# Altium project Logic_RF.PrjPcb
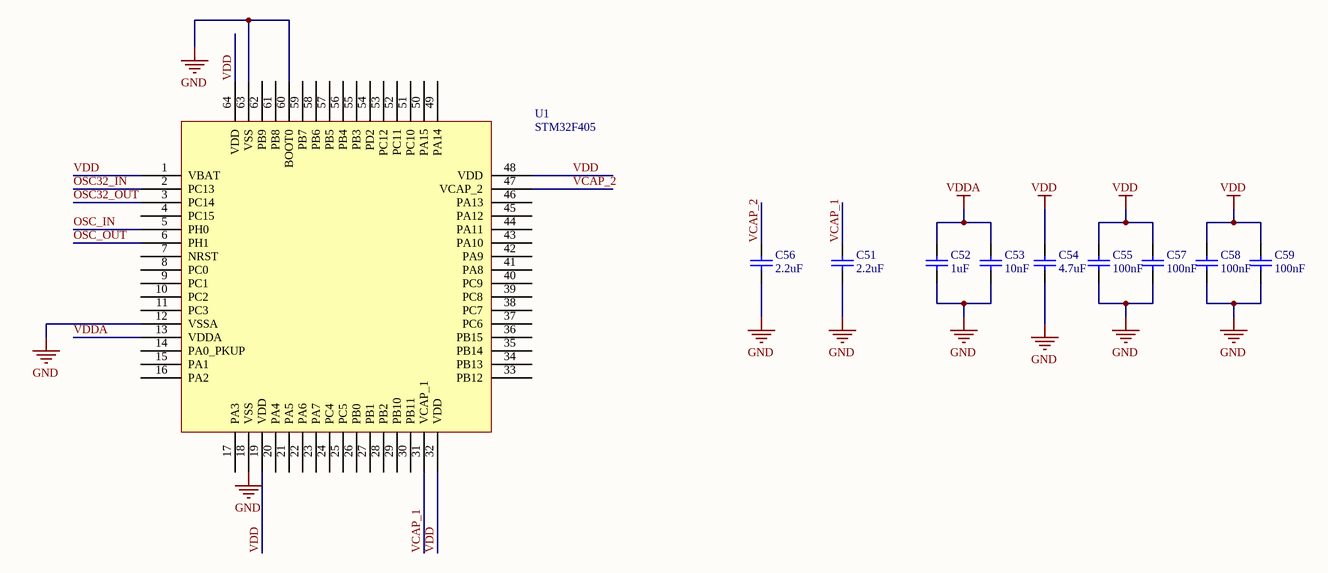
[diagram p0: MCU.SchDoc]
2 sheets, 39 parts. Net scope: flat (ports and power ports of the same name join across sheets).
Board file: Logic_RF.PcbDoc
Sheets:
  MCU.SchDoc
  Synth.SchDoc

## Sheet MCU.SchDoc
size A3; DocumentNumber: 2; SheetNumber: 2; SheetTotal: 5

### Parts
C51  value 2.2uF  [1608[0603]]  (hidden comment: Cap Semi)
C52  value 1uF  [1608[0603]]  (hidden comment: Cap Semi)
C53  value 10nF  [1608[0603]]  (hidden comment: Cap Semi)
C54  value 4.7uF  [1608[0603]]  (hidden comment: Cap Semi)
C55  value 100nF  [1608[0603]]  (hidden comment: Cap Semi)
C56  value 2.2uF  [1608[0603]]  (hidden comment: Cap Semi)
C57  value 100nF  [1608[0603]]  (hidden comment: Cap Semi)
C58  value 100nF  [1608[0603]]  (hidden comment: Cap Semi)
C59  value 100nF  [1608[0603]]  (hidden comment: Cap Semi)
U1  STM32F405  [SQFP50P1200X1200-64L]

### Nets
GND: C51.1 C52.1 C53.1 C54.1 C55.1 C56.1 C57.1 C58.1 C59.1 U1.12(VSSA) U1.18(VSS) U1.60(BOOT0) U1.63(VSS)
VDD: C54.2 C55.2 C57.2 C58.2 C59.2 U1.1(VBAT) U1.19(VDD) U1.32(VDD) U1.48(VDD) U1.64(VDD)
VDDA: C52.2 C53.2 U1.13(VDDA)
OSC32_IN: U1.2(PC13)
OSC32_OUT: U1.3(PC14)
OSC_IN: U1.5(PH0)
OSC_OUT: U1.6(PH1)
VCAP_1: C51.2 U1.31(VCAP_1)
VCAP_2: C56.2 U1.47(VCAP_2)

Not connected (* = marked no-connect by the designer): U1 4(PC15) 7(NRST) 8(PC0) 9(PC1) 10(PC2) 11(PC3) 14(PA0_PKUP) 15(PA1) 16(PA2) 17(PA3) 20(PA4) 21(PA5) 22(PA6) 23(PA7) 24(PC4) 25(PC5) 26(PB0) 27(PB1) 28(PB2) 29(PB10) 30(PB11) 33(PB12) 34(PB13) 35(PB14) 36(PB15) 37(PC6) 38(PC7) 39(PC8) 40(PC9) 41(PA8) 42(PA9) 43(PA10) 44(PA11) 45(PA12) 46(PA13) 49(PA14) 50(PA15) 51(PC10) 52(PC11) 53(PC12) 54(PD2) 55(PB3) 56(PB4) 57(PB5) 58(PB6) 59(PB7) 61(PB8) 62(PB9)

### Library data of the parts
C51-C59 = Cap Semi: Capacitor (Semiconductor SIM Model); Published: 8-Jun-2000; LatestRevisionDate: 29-May-2009; LatestRevisionNote: IPC-7351 Footprint Added.; PackageReference: C1206; Publisher: Altium Limited; PackageDescription: Chip Capacitor
U1 = STM32F405RG: ARM Cortex-M4 32 bit Microprocessor

## Sheet Synth.SchDoc
size A4; DocumentNumber: 3; SheetNumber: 3; SheetTotal: 5
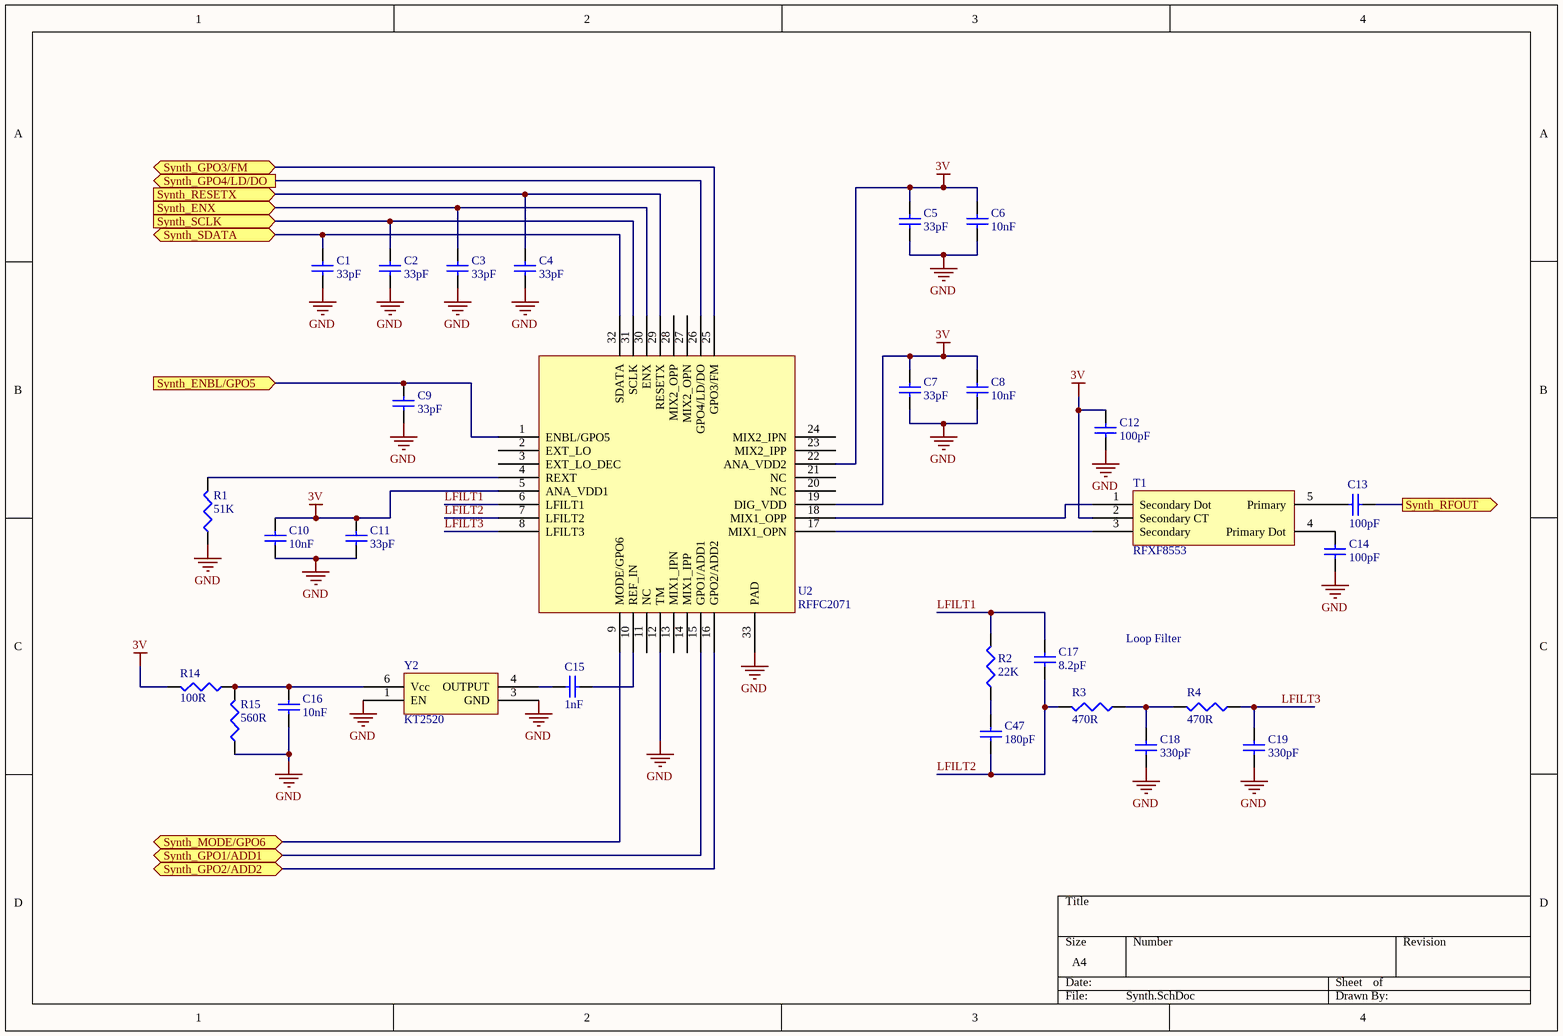
[diagram p1: Synth.SchDoc]

### Parts
C1  value 33pF  [1608[0603]]  (hidden comment: Cap Semi)
C2  value 33pF  [1608[0603]]  (hidden comment: Cap Semi)
C3  value 33pF  [1608[0603]]  (hidden comment: Cap Semi)
C4  value 33pF  [1608[0603]]  (hidden comment: Cap Semi)
C5  value 33pF  [1608[0603]]  (hidden comment: Cap Semi)
C6  value 10nF  [1608[0603]]  (hidden comment: Cap Semi)
C7  value 33pF  [1608[0603]]  (hidden comment: Cap Semi)
C8  value 10nF  [1608[0603]]  (hidden comment: Cap Semi)
C9  value 33pF  [1608[0603]]  (hidden comment: Cap Semi)
C10  value 10nF  [1608[0603]]  (hidden comment: Cap Semi)
C11  value 33pF  [1608[0603]]  (hidden comment: Cap Semi)
C12  value 100pF  [1608[0603]]  (hidden comment: Cap Semi)
C13  value 100pF  [1608[0603]]  (hidden comment: Cap Semi)
C14  value 100pF  [1608[0603]]  (hidden comment: Cap Semi)
C15  value 1nF  [1608[0603]]  (hidden comment: Cap Semi)
C16  value 10nF  [1608[0603]]  (hidden comment: Cap Semi)
C17  value 8.2pF  [1608[0603]]  (hidden comment: Cap Semi)
C18  value 330pF  [1608[0603]]  (hidden comment: Cap Semi)
C19  value 330pF  [1608[0603]]  (hidden comment: Cap Semi)
C47  value 180pF  [1608[0603]]  (hidden comment: Cap Semi)
R1  value 51K  [J1-0603]  (hidden comment: Res3)
R2  value 22K  [J1-0603]  (hidden comment: Res3)
R3  value 470R  [J1-0603]  (hidden comment: Res3)
R4  value 470R  [J1-0603]  (hidden comment: Res3)
R14  value 100R  [J1-0603]  (hidden comment: Res3)
R15  value 560R  [J1-0603]  (hidden comment: Res3)
T1  RFXF8553  [RFXF8553]
U2  RFFC2071  [QFN50P500X500-32WAL]
Y2  KT2520  [KT2520]

### Ports
Synth_ENBL/GPO5 (in), Synth_ENX (in), Synth_GPO1/ADD1 (bidir), Synth_GPO2/ADD2 (bidir), Synth_GPO3/FM (bidir), Synth_GPO4/LD/DO (out), Synth_MODE/GPO6 (bidir), Synth_RESETX (in), Synth_RFOUT (out), Synth_SCLK (in), Synth_SDATA

### Nets
3V: C5.1 C6.1 C7.1 C8.1 C10.2 C11.2 C12.1 R14.2 T1.2(Secondary_CT) U2.5(ANA_VDD1) U2.19(DIG_VDD) U2.22(ANA_VDD2)
GND: C1.1 C2.1 C3.1 C4.1 C5.2 C6.2 C7.2 C8.2 C9.1 C10.1 C11.1 C12.2 C14.1 C16.1 C18.1 C19.1 R1.1 R15.1 U2.12(TM) U2.33(PAD) Y2.1(EN) Y2.3(GND)
LFILT1: C17.2 R2.2 U2.6(LFILT1)
LFILT2: C17.1 C47.1 R3.2 U2.7(LFILT2)
LFILT3: C19.2 R4.1 U2.8(LFILT3)
NetC1_2: C1.2 U2.32(SDATA) ; port Synth_SDATA
NetC2_2: C2.2 U2.31(SCLK) ; port Synth_SCLK
NetC3_2: C3.2 U2.30(ENX) ; port Synth_ENX
NetC4_2: C4.2 U2.29(RESETX) ; port Synth_RESETX
NetC9_2: C9.2 U2.1(ENBL/GPO5) ; port Synth_ENBL/GPO5
NetC13_1: C13.1 T1.5(Primary)
NetC13_2: C13.2 ; port Synth_RFOUT
NetC14_2: C14.2 T1.4(Primary_Dot)
NetC15_1: C15.1 U2.10(REF_IN)
NetC15_2: C15.2 Y2.4(OUTPUT)
NetC16_2: C16.2 R14.1 R15.2 Y2.6(Vcc)
NetC18_2: C18.2 R3.1 R4.2
NetC47_2: C47.2 R2.1
NetR1_2: R1.2 U2.4(REXT)
NetT1_1: T1.1(Secondary_Dot) U2.18(MIX1_OPP)
NetT1_3: T1.3(Secondary) U2.17(MIX1_OPN)
NetU2_9: U2.9(MODE/GPO6) ; port Synth_MODE/GPO6
NetU2_15: U2.15(GPO1/ADD1) ; port Synth_GPO1/ADD1
NetU2_16: U2.16(GPO2/ADD2) ; port Synth_GPO2/ADD2
NetU2_25: U2.25(GPO3/FM) ; port Synth_GPO3/FM
NetU2_26: U2.26(GPO4/LD/DO) ; port Synth_GPO4/LD/DO

Not connected (* = marked no-connect by the designer): U2 2(EXT_LO) 3(EXT_LO_DEC) 11(NC) 13(MIX1_IPN) 14(MIX1_IPP) 20(NC) 21(NC) 23(MIX2_IPP) 24(MIX2_IPN) 27(MIX2_OPN) 28(MIX2_OPP)

### Notes on the sheet
- Loop Filter

### Library data of the parts
C1-C19 C47 = Cap Semi: Capacitor (Semiconductor SIM Model); Published: 8-Jun-2000; LatestRevisionDate: 29-May-2009; LatestRevisionNote: IPC-7351 Footprint Added.; PackageReference: C1206; Publisher: Altium Limited; PackageDescription: Chip Capacitor
R1-R4 R14 R15 = Res3: Resistor; Published: 8-Jun-2000; LatestRevisionDate: 29-May-2009; LatestRevisionNote: IPC-7351 Footprint Added.; PackageReference: J1-0603; Publisher: Altium Limited; PackageDescription: Chip Resistor
T1 = RFXF8553: 1:4 SMT TRANSFORMER
U2 = RFFC2071: 2.7GHz RF SYNTHESIZER/VCO WITH INTEGRATED RF MIXER
Y2 = KT2520: Temperature-Compensated Crystal Oscillator (TCXO) KT2520; Supplier 1: Mouser; Supplier Part Number 1: 581-KT2520P52ECW24TA

## Nets that join several sheets
GND: MCU (13 pins), Synth (22 pins)